# Altium schematic sheet 06_Logic_Level_Shifters.SchDoc
size A; SheetNumber: 7; SheetTotal: 8
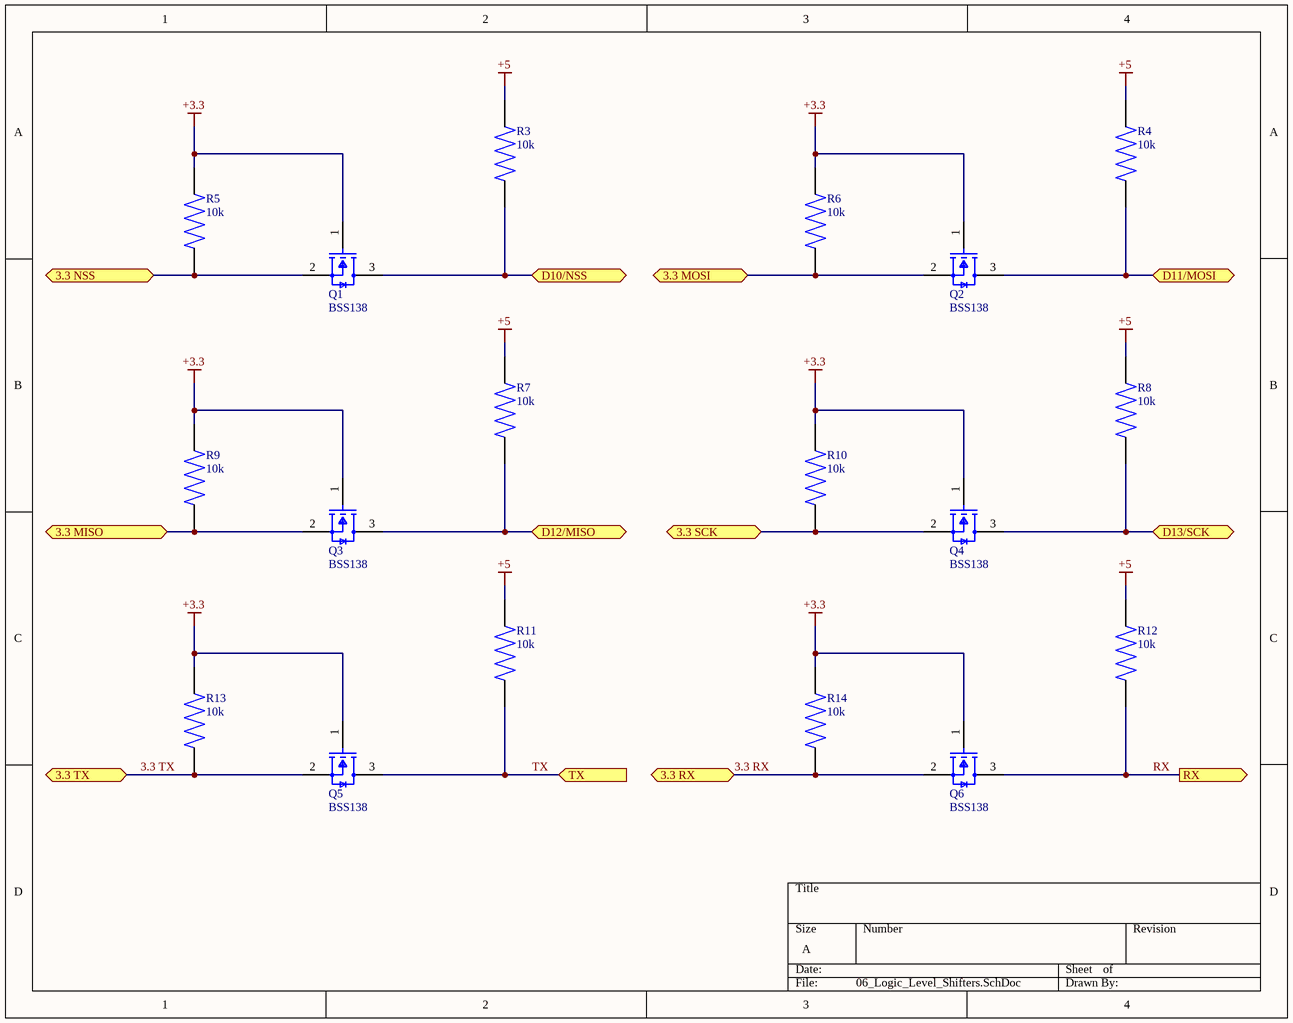
[diagram p0: 06_Logic_Level_Shifters.SchDoc]

## Parts
Q1  BSS138  [FP-318-08-IPC_B]
Q2  BSS138  [FP-318-08-IPC_B]
Q3  BSS138  [FP-318-08-IPC_B]
Q4  BSS138  [FP-318-08-IPC_B]
Q5  BSS138  [FP-318-08-IPC_B]
Q6  BSS138  [FP-318-08-IPC_B]
R3  10k  [RESC3115X65N]
R4  10k  [RESC3115X65N]
R5  10k  [RESC3115X65N]
R6  10k  [RESC3115X65N]
R7  10k  [RESC3115X65N]
R8  10k  [RESC3115X65N]
R9  10k  [RESC3115X65N]
R10  10k  [RESC3115X65N]
R11  10k  [RESC3115X65N]
R12  10k  [RESC3115X65N]
R13  10k  [RESC3115X65N]
R14  10k  [RESC3115X65N]

## Ports
3.3 MISO (bidir, see 00_Overview[4B], 04_Pin_Headers[1B]), 3.3 MOSI (bidir, see 00_Overview[4B], 04_Pin_Headers[1B]), 3.3 NSS (bidir, see 00_Overview[4C], 04_Pin_Headers[1B]), 3.3 RX (bidir, see 00_Overview[4C], 07_ESP-12F_Circuit[3B]), 3.3 SCK (bidir, see 00_Overview[4C], 04_Pin_Headers[3C]), 3.3 TX (bidir, see 00_Overview[4C], 07_ESP-12F_Circuit[3B]), D10/NSS (bidir, see 00_Overview[3C], 01_Microcontroller_Circuit[3B]), D11/MOSI (bidir, see 00_Overview[3C], 01_Microcontroller_Circuit[3B]), D12/MISO (bidir, see 00_Overview[3C], 01_Microcontroller_Circuit[3B]), D13/SCK (bidir, see 00_Overview[3C], 01_Microcontroller_Circuit[3B]), RX (out, see 00_Overview[3B]), TX (in, see 00_Overview[3B])

## Nets
+3.3: Q1.1(G) Q2.1(G) Q3.1(G) Q4.1(G) Q5.1(G) Q6.1(G) R5.2 R6.2 R9.2 R10.2 R13.2 R14.2
+5: R3.2 R4.2 R7.2 R8.2 R11.2 R12.2
3.3 MISO: Q3.2(S) R9.1 ; port 3.3 MISO
3.3 MOSI: Q2.2(S) R6.1 ; port 3.3 MOSI
3.3 NSS: Q1.2(S) R5.1 ; port 3.3 NSS
3.3 RX: Q6.2(S) R14.1 ; port 3.3 RX
3.3 SCK: Q4.2(S) R10.1 ; port 3.3 SCK
3.3 TX: Q5.2(S) R13.1 ; port 3.3 TX
D10/NSS: Q1.3(D) R3.1 ; port D10/NSS
D11/MOSI: Q2.3(D) R4.1 ; port D11/MOSI
D12/MISO: Q3.3(D) R7.1 ; port D12/MISO
D13/SCK: Q4.3(D) R8.1 ; port D13/SCK
RX: Q6.3(D) R12.1 ; port RX
TX: Q5.3(D) R11.1 ; port TX

## Library data of the parts
Q1-Q6 = CMP-07173-000101-1: MOSFET N-CH 50V 220MA SOT-23; Turn-Off Delay Time: 20ns; Element Configuration: Single; Rds On Max: 3.5R; Gate to Source Voltage (Vgs): 20V; Threshold Voltage: 1.3V; Number of Elements: 1; Power Dissipation: 360mW; Rise Time: 9ns; Turn-On Delay Time: 2.5ns; Input Capacitance: 27pF; On-State Resistance: 6R; Lead Free: Lead Free; Length: 2.92mm; Width: 1.3mm; Drain to Source Breakdown Voltage: 50V; Min Operating Temperature: -55°C; REACH SVHC: No SVHC; Packaging: Tape and Reel; Radiation Hardening: No; Height: 0.93mm; Drain to Source Voltage (Vdss): 50V; Current Rating: 220mA; Voltage Rating (DC): 50V; Weight: 0.03g; Continuous Drain Current (ID): 220mA; Number of Pins: 3; Nominal Vgs: 1.3V; Max Power Dissipation: 360mW; Fall Time: 9ns; Drain to Source Resistance: 3.5R; Contact Plating: Tin; Case/Package: SOT-23; Package Quantity: 1; Dual Supply Voltage: 50V; Mount: Surface Mount; Termination: SMD/SMT; Max Operating Temperature: 150°C
R3-R14 = CRG1206F4K7/10: Res Thick Film 1206 4.7K Ohm 1% 0.25W(1/4W) Â±100ppm/C Pad SMD T/R; Power_Rating: .25 W; MF: TE Connectivity; Voltage_Rating: 200 V; SnapEDA_Link: https://www.snapeda.com/parts/CRG1206F4K7/10/TE+Connectivity/view-part/?ref=snap; Package: 1206; Resistance: 4.7K; Value: *; MP: CRG1206F4K7/10; EU_RoHS_Compliance: Compliant with Exemptions; Tolerance: 1%; Check_prices: https://www.snapeda.com/parts/CRG1206F4K7/10/TE+Connectivity/view-part/?ref=eda